# Altium project Photovoltaic Controller.PrjPcb (part 2 of 4)

## Sheet Controller.SchDoc: Controller
size A4; Project_Name: - - - - -; ApprovedBy: LD Stanton; CheckedBy: None; Author: LD Stanton; CompanyName: University of Cape Town; DrawnBy: Lawrence Stanton; Engineer: Lawrence Stanton; Organization: University of Cape Town; Address1: Department of Electrical Engineering; Address2: Rondebosch; Address3: Cape Town; Address4: South Africa 7701; DocumentNumber: 5; SheetNumber: 5; SheetTotal: 20; Approv_Date_Eng: --/--/----; Approv_Date_Chk: --/--/----; PCB_Doc: TBD; ASM_Doc: TBD; FAB_Doc: TBD; CML_Doc: TBD; BOM_Doc: TBD
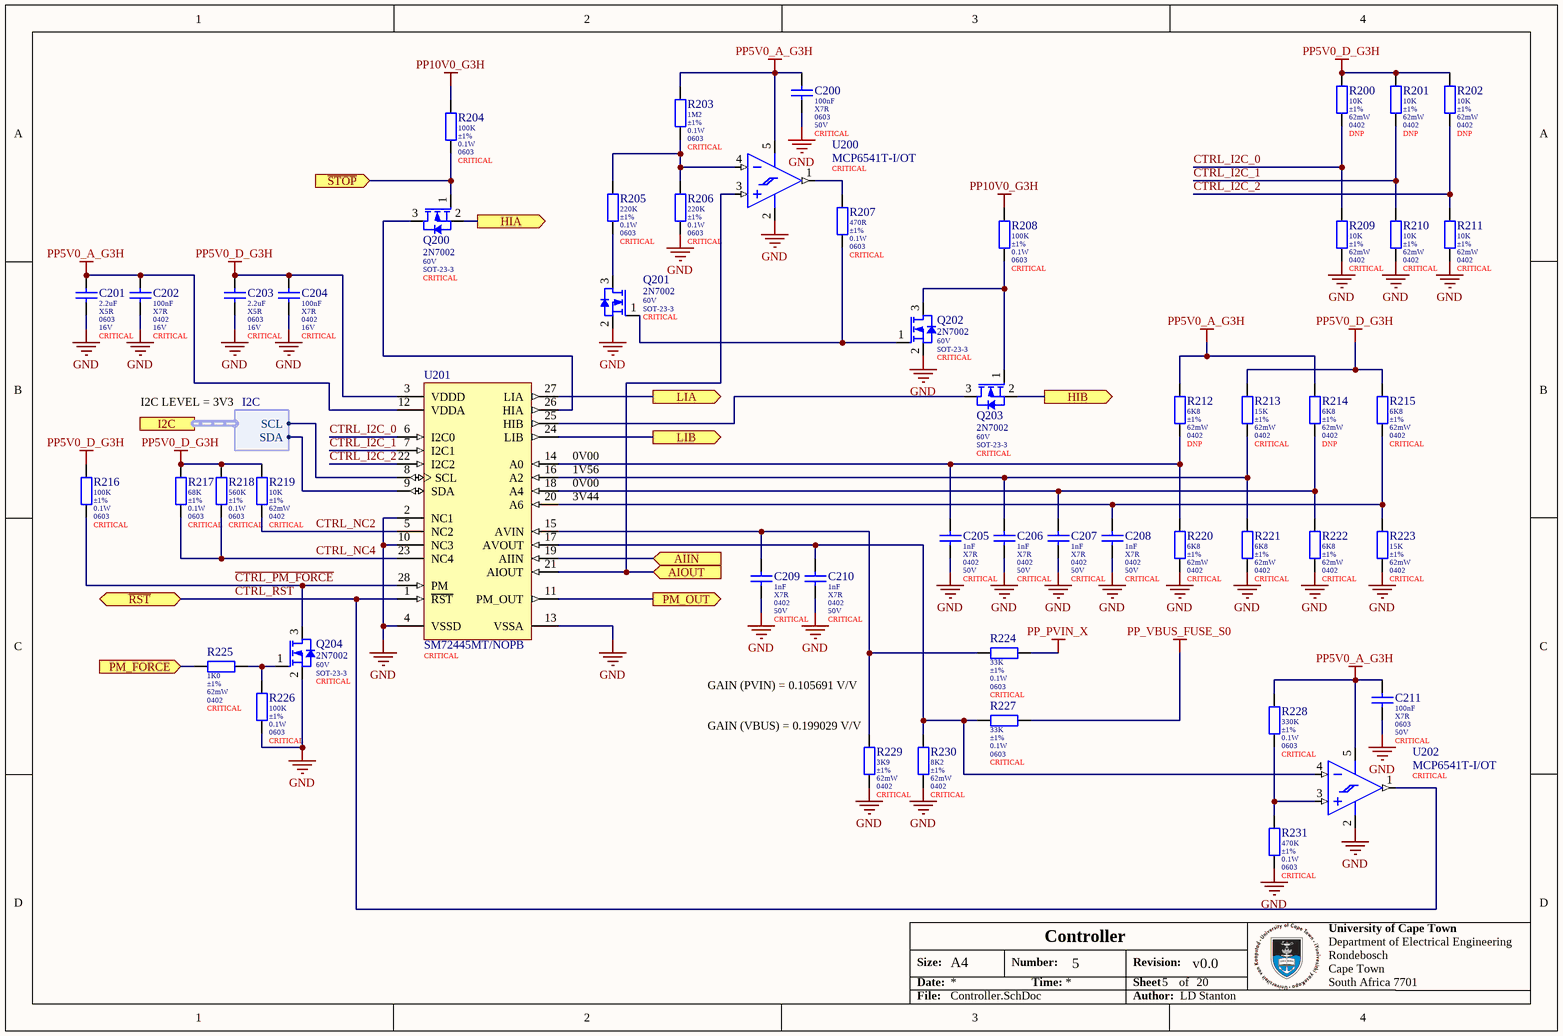
[diagram p7: Controller.SchDoc]

### Parts
C200  value 100nF  Dielectric: X7R  Package: 0603  Voltage: 50V  Populate: CRITICAL  [0603 (Yageo DA) B]  (hidden comment: CC0603KRX7R9BB104)
C201  value 2.2uF  Dielectric: X5R  Package: 0603  Voltage: 16V  Populate: CRITICAL  [0603_080_8 (Samsung) B]  (hidden comment: CL10A225KO8NNNC)
C202  value 100nF  Dielectric: X7R  Package: 0402  Voltage: 16V  Populate: CRITICAL  [0402_050_5 (Samsumg) B]  (hidden comment: CL05B104KO5NNNC)
C203  value 2.2uF  Dielectric: X5R  Package: 0603  Voltage: 16V  Populate: CRITICAL  [0603_080_8 (Samsung) B]  (hidden comment: CL10A225KO8NNNC)
C204  value 100nF  Dielectric: X7R  Package: 0402  Voltage: 16V  Populate: CRITICAL  [0402_050_5 (Samsumg) B]  (hidden comment: CL05B104KO5NNNC)
C205  value 1nF  Dielectric: X7R  Package: 0402  Voltage: 50V  Populate: CRITICAL  [0402_050 (Guandong) B]  (hidden comment: 0402B102K500NT)
C206  value 1nF  Dielectric: X7R  Package: 0402  Voltage: 50V  Populate: CRITICAL  [0402_050 (Guandong) B]  (hidden comment: 0402B102K500NT)
C207  value 1nF  Dielectric: X7R  Package: 0402  Voltage: 50V  Populate: CRITICAL  [0402_050 (Guandong) B]  (hidden comment: 0402B102K500NT)
C208  value 1nF  Dielectric: X7R  Package: 0402  Voltage: 50V  Populate: CRITICAL  [0402_050 (Guandong) B]  (hidden comment: 0402B102K500NT)
C209  value 1nF  Dielectric: X7R  Package: 0402  Voltage: 50V  Populate: CRITICAL  [0402_050 (Guandong) B]  (hidden comment: 0402B102K500NT)
C210  value 1nF  Dielectric: X7R  Package: 0402  Voltage: 50V  Populate: CRITICAL  [0402_050 (Guandong) B]  (hidden comment: 0402B102K500NT)
C211  value 100nF  Dielectric: X7R  Package: 0603  Voltage: 50V  Populate: CRITICAL  [0603 (Yageo DA) B]  (hidden comment: CC0603KRX7R9BB104)
Q200  2N7002  Maximum Drain Source Voltage: 60V  Package: SOT-23-3  Placement: CRITICAL  [SOT-23-3 (2N7002) B]
Q201  2N7002  Maximum Drain Source Voltage: 60V  Package: SOT-23-3  Placement: CRITICAL  [SOT-23-3 (2N7002) B]
Q202  2N7002  Maximum Drain Source Voltage: 60V  Package: SOT-23-3  Placement: CRITICAL  [SOT-23-3 (2N7002) B]
Q203  2N7002  Maximum Drain Source Voltage: 60V  Package: SOT-23-3  Placement: CRITICAL  [SOT-23-3 (2N7002) B]
Q204  2N7002  Maximum Drain Source Voltage: 60V  Package: SOT-23-3  Placement: CRITICAL  [SOT-23-3 (2N7002) B]
R200  value 10K  Tolerance: ±1%  Power: 62mW  Package: 0402  Populate: DNP  [0402 (Uniroyal) B]  (hidden comment: 0402WGF1002TCE)
R201  value 10K  Tolerance: ±1%  Power: 62mW  Package: 0402  Populate: DNP  [0402 (Uniroyal) B]  (hidden comment: 0402WGF1002TCE)
R202  value 10K  Tolerance: ±1%  Power: 62mW  Package: 0402  Populate: DNP  [0402 (Uniroyal) B]  (hidden comment: 0402WGF1002TCE)
R203  value 1M2  Tolerance: ±1%  Power: 0.1W  Package: 0603  Populate: CRITICAL  [0603 (Uniroyal) B]  (hidden comment: 0603WAF1204T5E)
R204  value 100K  Tolerance: ±1%  Power: 0.1W  Package: 0603  Populate: CRITICAL  [0603 (Uniroyal) B]  (hidden comment: 0603WAF1003T5E)
R205  value 220K  Tolerance: ±1%  Power: 0.1W  Package: 0603  Populate: CRITICAL  [0603 (Uniroyal) B]  (hidden comment: 0603WAF2203T5E)
R206  value 220K  Tolerance: ±1%  Power: 0.1W  Package: 0603  Populate: CRITICAL  [0603 (Uniroyal) B]  (hidden comment: 0603WAF2203T5E)
R207  value 470R  Tolerance: ±1%  Power: 0.1W  Package: 0603  Populate: CRITICAL  [0603 (Uniroyal) B]  (hidden comment: 0603WAF4700T5E)
R208  value 100K  Tolerance: ±1%  Power: 0.1W  Package: 0603  Populate: CRITICAL  [0603 (Uniroyal) B]  (hidden comment: 0603WAF1003T5E)
R209  value 10K  Tolerance: ±1%  Power: 62mW  Package: 0402  Populate: CRITICAL  [0402 (Uniroyal) B]  (hidden comment: 0402WGF1002TCE)
R210  value 10K  Tolerance: ±1%  Power: 62mW  Package: 0402  Populate: CRITICAL  [0402 (Uniroyal) B]  (hidden comment: 0402WGF1002TCE)
R211  value 10K  Tolerance: ±1%  Power: 62mW  Package: 0402  Populate: CRITICAL  [0402 (Uniroyal) B]  (hidden comment: 0402WGF1002TCE)
R212  value 6K8  Tolerance: ±1%  Power: 62mW  Package: 0402  Populate: DNP  [0402 (Uniroyal) B]  (hidden comment: 0402WGF6801TCE)
R213  value 15K  Tolerance: ±1%  Power: 62mW  Package: 0402  Populate: CRITICAL  [0402 (Uniroyal) B]  (hidden comment: 0402WGF1502TCE)
R214  value 6K8  Tolerance: ±1%  Power: 62mW  Package: 0402  Populate: DNP  [0402 (Uniroyal) B]  (hidden comment: 0402WGF6801TCE)
R215  value 6K8  Tolerance: ±1%  Power: 62mW  Package: 0402  Populate: CRITICAL  [0402 (Uniroyal) B]  (hidden comment: 0402WGF6801TCE)
R216  value 100K  Tolerance: ±1%  Power: 0.1W  Package: 0603  Populate: CRITICAL  [0603 (Uniroyal) B]  (hidden comment: 0603WAF1003T5E)
R217  value 68K  Tolerance: ±1%  Power: 0.1W  Package: 0603  Populate: CRITICAL  [0603 (Uniroyal) B]  (hidden comment: 0603WAF6802T5E)
R218  value 560K  Tolerance: ±1%  Power: 0.1W  Package: 0603  Populate: CRITICAL  [0603 (Uniroyal) B]  (hidden comment: 0603WAF5603T5E)
R219  value 10K  Tolerance: ±1%  Power: 62mW  Package: 0402  Populate: CRITICAL  [0402 (Uniroyal) B]  (hidden comment: 0402WGF1002TCE)
R220  value 6K8  Tolerance: ±1%  Power: 62mW  Package: 0402  Populate: CRITICAL  [0402 (Uniroyal) B]  (hidden comment: 0402WGF6801TCE)
R221  value 6K8  Tolerance: ±1%  Power: 62mW  Package: 0402  Populate: CRITICAL  [0402 (Uniroyal) B]  (hidden comment: 0402WGF6801TCE)
R222  value 6K8  Tolerance: ±1%  Power: 62mW  Package: 0402  Populate: CRITICAL  [0402 (Uniroyal) B]  (hidden comment: 0402WGF6801TCE)
R223  value 15K  Tolerance: ±1%  Power: 62mW  Package: 0402  Populate: CRITICAL  [0402 (Uniroyal) B]  (hidden comment: 0402WGF1502TCE)
R224  value 33K  Tolerance: ±1%  Power: 0.1W  Package: 0603  Populate: CRITICAL  [0603 (Uniroyal) B]  (hidden comment: 0603WAF3302T5E)
R225  value 1K0  Tolerance: ±1%  Power: 62mW  Package: 0402  Populate: CRITICAL  [0402 (Uniroyal) B]  (hidden comment: 0402WGF1001TCE)
R226  value 100K  Tolerance: ±1%  Power: 0.1W  Package: 0603  Populate: CRITICAL  [0603 (Uniroyal) B]  (hidden comment: 0603WAF1003T5E)
R227  value 33K  Tolerance: ±1%  Power: 0.1W  Package: 0603  Populate: CRITICAL  [0603 (Uniroyal) B]  (hidden comment: 0603WAF3302T5E)
R228  value 330K  Tolerance: ±1%  Power: 0.1W  Package: 0603  Populate: CRITICAL  [0603 (Uniroyal) B]  (hidden comment: 0603WAF3303T5E)
R229  value 3K9  Tolerance: ±1%  Power: 62mW  Package: 0402  Populate: CRITICAL  [0402 (Uniroyal) B]  (hidden comment: 0402WGF3901TCE)
R230  value 8K2  Tolerance: ±1%  Power: 62mW  Package: 0402  Populate: CRITICAL  [0402 (Uniroyal) B]  (hidden comment: 0402WGF8201TCE)
R231  value 470K  Tolerance: ±1%  Power: 0.1W  Package: 0603  Populate: CRITICAL  [0603 (Uniroyal) B]  (hidden comment: 0603WAF4703T5E)
U200  MCP6541T-I/OT  Placement: CRITICAL  [SOT-23-5 (MCP75x) B]
U201  SM72445MT/NOPB  Placement: CRITICAL  [PW0028A_N]
U202  MCP6541T-I/OT  Placement: CRITICAL  [SOT-23-5 (MCP75x) B]

### Ports
AIIN (in), AIOUT (in), HIA (out), HIB (out), I2C (harness I2C), LIA (out), LIB (out), PM_FORCE (in), PM_OUT (out), ~{RST} (bidir), ~{STOP} (in)

### Harnesses
I2C: SCL, SDA

### Nets
GND: C200.2 C201.2 C202.2 C203.2 C204.2 C205.2 C206.2 C207.2 C208.2 C209.2 C210.2 C211.2 Q201.2(S) Q202.2(S) Q204.2(S) R206.2 R209.2 R210.2 R211.2 R220.2 R221.2 R222.2 R223.2 R226.2 R229.2 R230.2 R231.2 U200.2(VSS) U201.2(NC1) U201.4(VSSD) U201.10(NC3) U201.13(VSSA) U202.2(VSS)
PP5V0_A_G3H: C200.1 C201.1 C202.1 C211.1 R203.1 R212.1 R214.1 R228.1 U200.5(VDD) U201.12(VDDA) U202.5(VDD)
PP5V0_D_G3H: C203.1 C204.1 R200.1 R201.1 R202.1 R213.1 R215.1 R216.1 R217.1 R218.1 R219.2 U201.3(VDDD)
PP10V0_G3H: R204.1 R208.1
PP_PVIN_X: R224.2
PP_VBUS_FUSE_S0: R227.2
~{CTRL_PM_FORCE}: Q204.3(D) R216.2 U201.28(PM)
~{CTRL_RST}: U201.1(~{RST}) U202.1(OUT) ; port ~{RST}  [project net CTRL_RST]
~{STOP}: Q200.1(G) R204.2 ; port ~{STOP}
CTRL_I2C_0: R200.2 R209.1 U201.6(I2C0)
CTRL_I2C_1: R201.2 R210.1 U201.7(I2C1)
CTRL_I2C_2: R202.2 R211.1 U201.22(I2C2)
CTRL_NC2: R219.1 U201.5(NC2)
CTRL_NC4: R217.2 R218.2 U201.23(NC4)
HIA: Q200.2(S) ; port HIA
HIB: Q203.2(S) ; port HIB
I2C2.SCL: U201.8(SCL) ; port I2C.SCL
I2C2.SDA: U201.9(SDA) ; port I2C.SDA
I_IN: U201.19(AIIN) ; port AIIN
I_OUT: U200.3(VIN+) U201.21(AIOUT) ; port AIOUT
LIA: U201.27(LIA) ; port LIA
LIB: U201.24(LIB) ; port LIB
PM_FORCE: R225.1 ; port PM_FORCE
PM_OUT: U201.11(PM_OUT) ; port PM_OUT
NetC205_1: C205.1 R212.2 R220.1 U201.14(A0)
NetC206_1: C206.1 R213.2 R221.1 U201.16(A2)
NetC207_1: C207.1 R214.2 R222.1 U201.18(A4)
NetC208_1: C208.1 R215.2 R223.1 U201.20(A6)
NetC209_1: C209.1 R224.1 R229.1 U201.15(AVIN)
NetC210_1: C210.1 R227.1 R230.1 U201.17(AVOUT) U202.4(VIN-)
NetQ200_3: Q200.3(D) U201.26(HIA)
NetQ201_1: Q201.1(G) Q202.1(G) R207.1
NetQ201_3: Q201.3(D) R205.2
NetQ202_3: Q202.3(D) Q203.1(G) R208.2
NetQ203_3: Q203.3(D) U201.25(HIB)
NetQ204_1: Q204.1(G) R225.2 R226.1
NetR203_2: R203.2 R205.1 R206.1 U200.4(VIN-)
NetR207_2: R207.2 U200.1(OUT)
NetR228_2: R228.2 R231.1 U202.3(VIN+)

### Notes on the sheet
- I2C LEVEL = 3V3
- (near U201) 1V56
- (near U201) 0V00
- (near U201) 3V44
- GAIN (PVIN) = 0.105691 V/V
- (near R229) GAIN (VBUS) = 0.199029 V/V
- Size:
- Date:
- A4
- Number:
- Time:
- Revision:
- Sheet
- of
- File:
- Author:

### Library data of the parts
C200 C211 = CMP-047-000000-7: as C424 on sheet RS485 Tranciever; LCSC Part Number: C14663; Tolerance: ±10%; ComponentLink1URL: https://datasheet.lcsc.com/szlcsc/YAGEO-CC0603KRX7R9BB104_C14663.pdf; ComponentLink1Description: Datasheet
C201 C203 = CMP-045-000016-8: MLCC 2.2uF 0603 16V X5R ±10%; Manufacturer: Samsung; ComponentLink1URL: https://datasheet.lcsc.com/szlcsc/Samsung-Electro-Mechanics-CL05C100JB5NNNC_C32949.pdf; LCSC Part Number: C23630; Tolerance: ±10%; ComponentLink1Description: Datasheet
C202 C204 = CMP-045-000014-12: as C401 on sheet MCU; Tolerance: ±10%; ComponentLink1Description: Datasheet; ComponentLink1URL: https://datasheet.lcsc.com/szlcsc/Samsung-Electro-Mechanics-CL05C100JB5NNNC_C32949.pdf; LCSC Part Number: C1525
C205-C210 = CMP-014-000001-9: MLCC 1nF 0402 50V X7R ±10%; Manufacturer: Guandong; LCSC Part Number: C1523; ComponentLink1URL: https://datasheet.lcsc.com/szlcsc/Guangdong-Fenghua-Advanced-Tech-0402B102K500NT_C1523.pdf; ComponentLink1Description: Datasheet; Tolerance: ±10%
Q200-Q204 = CMP-040-000000-14: Small Signal MOSFET, 500 mA, 60 V, N-Channel, Enhancement, JCET SOT-23-3; Gate Threshold Voltage: 2V5; Power: 0.225W; Maximum Drain Current: 0.2A; Maximum Gate Source Voltage: ±20V; Drain-Source On Resistance: 7R; ComponentLink1Description: Datasheet; LCSC Part Number: C8545; ComponentLink1URL: https://datasheet.lcsc.com/szlcsc/Changjiang-Electronics-Tech-CJ-2N7002_C8545.pdf; Manufacturer: JCET
R200-R202 R209-R211 R219 = CMP-010-000292-12: Resistor 10K 0402 ±1% Thick Film Uniroyal; Working Voltage: 50V; Temperature Coefficient: ±100ppm/K; Manufacturer: Uniroyal; Pin Count: 2; ComponentLink1URL: https://datasheet.lcsc.com/szlcsc/1811062009_UNI-ROYAL-Uniroyal-Elec-0603WAF1002T5E_C25804.pdf; LCSC Part Number: C25744; Temperature: -55 - 155°C; ComponentLink1Description: Datasheet
R203 = CMP-010-000374-4: Resistor 1M2 0603 ±1% Thick Film Uniroyal; Temperature Coefficient: ±100ppm/K; Working Voltage: 75V; Temperature: -55 - 155°C; Pin Count: 2; ComponentLink1URL: https://datasheet.lcsc.com/szlcsc/1811062009_UNI-ROYAL-Uniroyal-Elec-0603WAF1002T5E_C25804.pdf; Manufacturer: Uniroyal; LCSC Part Number: C13315; ComponentLink1Description: Datasheet
R204 R208 R216 R226 = CMP-010-000288-10: as R412 on sheet MCU; Manufacturer: Uniroyal; ComponentLink1URL: https://datasheet.lcsc.com/szlcsc/1811062009_UNI-ROYAL-Uniroyal-Elec-0603WAF1002T5E_C25804.pdf; LCSC Part Number: C25803; Temperature: -55 - 155°C; ComponentLink1Description: Datasheet; Pin Count: 2
R205 R206 = CMP-010-000401-2: Resistor 220K 0603 ±1% Thick Film Uniroyal; Temperature Coefficient: ±100ppm/K; Working Voltage: 75V; ComponentLink1URL: https://datasheet.lcsc.com/szlcsc/1811062009_UNI-ROYAL-Uniroyal-Elec-0603WAF1002T5E_C25804.pdf; Manufacturer: Uniroyal; LCSC Part Number: C22961; Temperature: -55 - 155°C; Pin Count: 2; ComponentLink1Description: Datasheet
R207 = CMP-010-000381-2: Resistor 470R 0603 ±5% Thick Film Uniroyal; Working Voltage: 75V; Temperature Coefficient: ±100ppm/K; ComponentLink1Description: Datasheet; Manufacturer: Uniroyal; Temperature: -55 - 155°C; LCSC Part Number: C23179; ComponentLink1URL: https://datasheet.lcsc.com/szlcsc/1811062009_UNI-ROYAL-Uniroyal-Elec-0603WAF1002T5E_C25804.pdf; Pin Count: 2
R212 R214 R215 R220-R222 = CMP-010-000385-1: Resistor 6K8 0402 ±1% Thick Film Uniroyal; Temperature Coefficient: ±100ppm/K; Working Voltage: 50V; Manufacturer: Uniroyal; LCSC Part Number: C25917; ComponentLink1Description: Datasheet; Temperature: -55 - 155°C; ComponentLink1URL: https://datasheet.lcsc.com/szlcsc/1811062009_UNI-ROYAL-Uniroyal-Elec-0603WAF1002T5E_C25804.pdf; Pin Count: 2
R213 R223 = CMP-010-000399-1: Resistor 15K 0402 ±1% Thick Film Uniroyal; Working Voltage: 50V; Temperature Coefficient: ±100ppm/K; ComponentLink1Description: Datasheet; Manufacturer: Uniroyal; Temperature: -55 - 155°C; LCSC Part Number: C25756; ComponentLink1URL: https://datasheet.lcsc.com/szlcsc/1811062009_UNI-ROYAL-Uniroyal-Elec-0603WAF1002T5E_C25804.pdf; Pin Count: 2
R217 = CMP-010-000350-9: Resistor 68K 0603 ±1% Thick Film Uniroyal; Working Voltage: 75V; Temperature Coefficient: ±100ppm/K; ComponentLink1Description: Datasheet; LCSC Part Number: C23231; ComponentLink1URL: https://datasheet.lcsc.com/szlcsc/1811062009_UNI-ROYAL-Uniroyal-Elec-0603WAF1002T5E_C25804.pdf; Temperature: -55 - 155°C; Pin Count: 2; Manufacturer: Uniroyal
R218 = CMP-010-000354-6: Resistor 560K 0603 ±1% Thick Film Uniroyal; Working Voltage: 75V; Temperature Coefficient: ±100ppm/K; Temperature: -55 - 155°C; Pin Count: 2; ComponentLink1URL: https://datasheet.lcsc.com/szlcsc/1811062009_UNI-ROYAL-Uniroyal-Elec-0603WAF1002T5E_C25804.pdf; ComponentLink1Description: Datasheet; LCSC Part Number: C23203; Manufacturer: Uniroyal
R224 R227 = CMP-010-000332-10: Resistor 33K 0603 ±1% Thick Film Uniroyal; Working Voltage: 75V; Temperature Coefficient: ±100ppm/K; Temperature: -55 - 155°C; ComponentLink1URL: https://datasheet.lcsc.com/szlcsc/1811062009_UNI-ROYAL-Uniroyal-Elec-0603WAF1002T5E_C25804.pdf; Manufacturer: Uniroyal; LCSC Part Number: C4216; ComponentLink1Description: Datasheet; Pin Count: 2
R225 = CMP-010-000307-13: Resistor 1K0 0402 ±1% Thick Film Uniroyal; Working Voltage: 50V; Temperature Coefficient: ±100ppm/K; Temperature: -55 - 155°C; ComponentLink1URL: https://datasheet.lcsc.com/szlcsc/1811062009_UNI-ROYAL-Uniroyal-Elec-0603WAF1002T5E_C25804.pdf; Manufacturer: Uniroyal; Pin Count: 2; ComponentLink1Description: Datasheet; LCSC Part Number: C11702
R228 = CMP-010-000382-2: Resistor 330K 0603 ±1% Thick Film Uniroyal; Temperature Coefficient: ±100ppm/K; Working Voltage: 75V; Pin Count: 2; Manufacturer: Uniroyal; ComponentLink1URL: https://datasheet.lcsc.com/szlcsc/1811062009_UNI-ROYAL-Uniroyal-Elec-0603WAF1002T5E_C25804.pdf; LCSC Part Number: C23137; Temperature: -55 - 155°C; ComponentLink1Description: Datasheet
R229 = CMP-010-000334-13: Resistor 3K9 0402 ±1% Thick Film Uniroyal; Working Voltage: 50V; Temperature Coefficient: ±100ppm/K; Manufacturer: Uniroyal; LCSC Part Number: C51721; Temperature: -55 - 155°C; ComponentLink1URL: https://datasheet.lcsc.com/szlcsc/1811062009_UNI-ROYAL-Uniroyal-Elec-0603WAF1002T5E_C25804.pdf; ComponentLink1Description: Datasheet; Pin Count: 2
R230 = CMP-010-000386-1: Resistor 8K2 0402 ±1% Thick Film Uniroyal; Working Voltage: 50V; Temperature Coefficient: ±100ppm/K; ComponentLink1Description: Datasheet; ComponentLink1URL: https://datasheet.lcsc.com/szlcsc/1811062009_UNI-ROYAL-Uniroyal-Elec-0603WAF1002T5E_C25804.pdf; LCSC Part Number: C25924; Manufacturer: Uniroyal; Temperature: -55 - 155°C; Pin Count: 2
R231 = CMP-010-000402-2: Resistor 470K 0603 ±1% Thick Film Uniroyal; Temperature Coefficient: ±100ppm/K; Working Voltage: 75V; ComponentLink1URL: https://datasheet.lcsc.com/szlcsc/1811062009_UNI-ROYAL-Uniroyal-Elec-0603WAF1002T5E_C25804.pdf; Pin Count: 2; Temperature: -55 - 155°C; LCSC Part Number: C23178; ComponentLink1Description: Datasheet; Manufacturer: Uniroyal
U200 U202 = CMP-000025-4: Comparator, Push-Pull, 1V6-5V5, 600nA,  SOT-23-5; Min Supply Voltage: 1.6V; Max Supply Voltage: 5.5V; Propagation Delay: 8us; Quiescent Current: 1uA; Nominal Supply Current: 1mA; Input Bias Current: 1pA; Input Offset Voltage (Vos): 7mV; Hysteresis: 6.5mV; Output Current: 2mA; Package: SOT-23-5; ComponentLink1Description: Datasheet; Output Type: Push-Pull; Min Operating Temperature: -40°C; RoHS: Yes; Max Operating Temperature: 85°C; ComponentLink1URL: https://ww1.microchip.com/downloads/en/DeviceDoc/MCP6541%20Output%20SubMicroamp%20Comparators%2020001696K.pdf; LCSC Part Number: C80839
U201 = CMP-019-00000-4: Texas Instruments MPPT Photovoltaic Cell Controller, 220kHz, TSSOP-28; Min Input Voltage: 4.75V; Input Current: 10nA; Max Supply Voltage: 5.25V; Supply Current: 11.5mA; RoHS: Yes; Max Operating Temperature: 105°C; Min Operating Temperature: -40°C; Height: 0.9mm; ComponentLink1URL: https://www.ti.com/lit/ds/symlink/sm72442.pdf?ts=1624215339045&ref_url=https%253A%252F%252Fwww.ti.com%252Fproduct%252FSM72442; ComponentLink1Description: Datasheet; Max Input Voltage: 5.25V; Case/Package: TSSOP; Min Supply Voltage: 4.75V

## Sheet Bridge Regulator.SchDoc: Full Bridge Regulator
size A4; ApprovedBy: LD Stanton; CheckedBy: None; Author: LD Stanton; CompanyName: University of Cape Town; DrawnBy: Lawrence Stanton; Engineer: Lawrence Stanton; Organization: University of Cape Town; Address1: Department of Electrical Engineering; Address2: Rondebosch; Address3: Cape Town; Address4: South Africa 7701; DocumentNumber: 6; SheetNumber: 6; SheetTotal: 20; Approv_Date_Eng: --/--/----; Approv_Date_Chk: --/--/----; PCB_Doc: TBD; ASM_Doc: TBD; FAB_Doc: TBD; CML_Doc: TBD; BOM_Doc: TBD
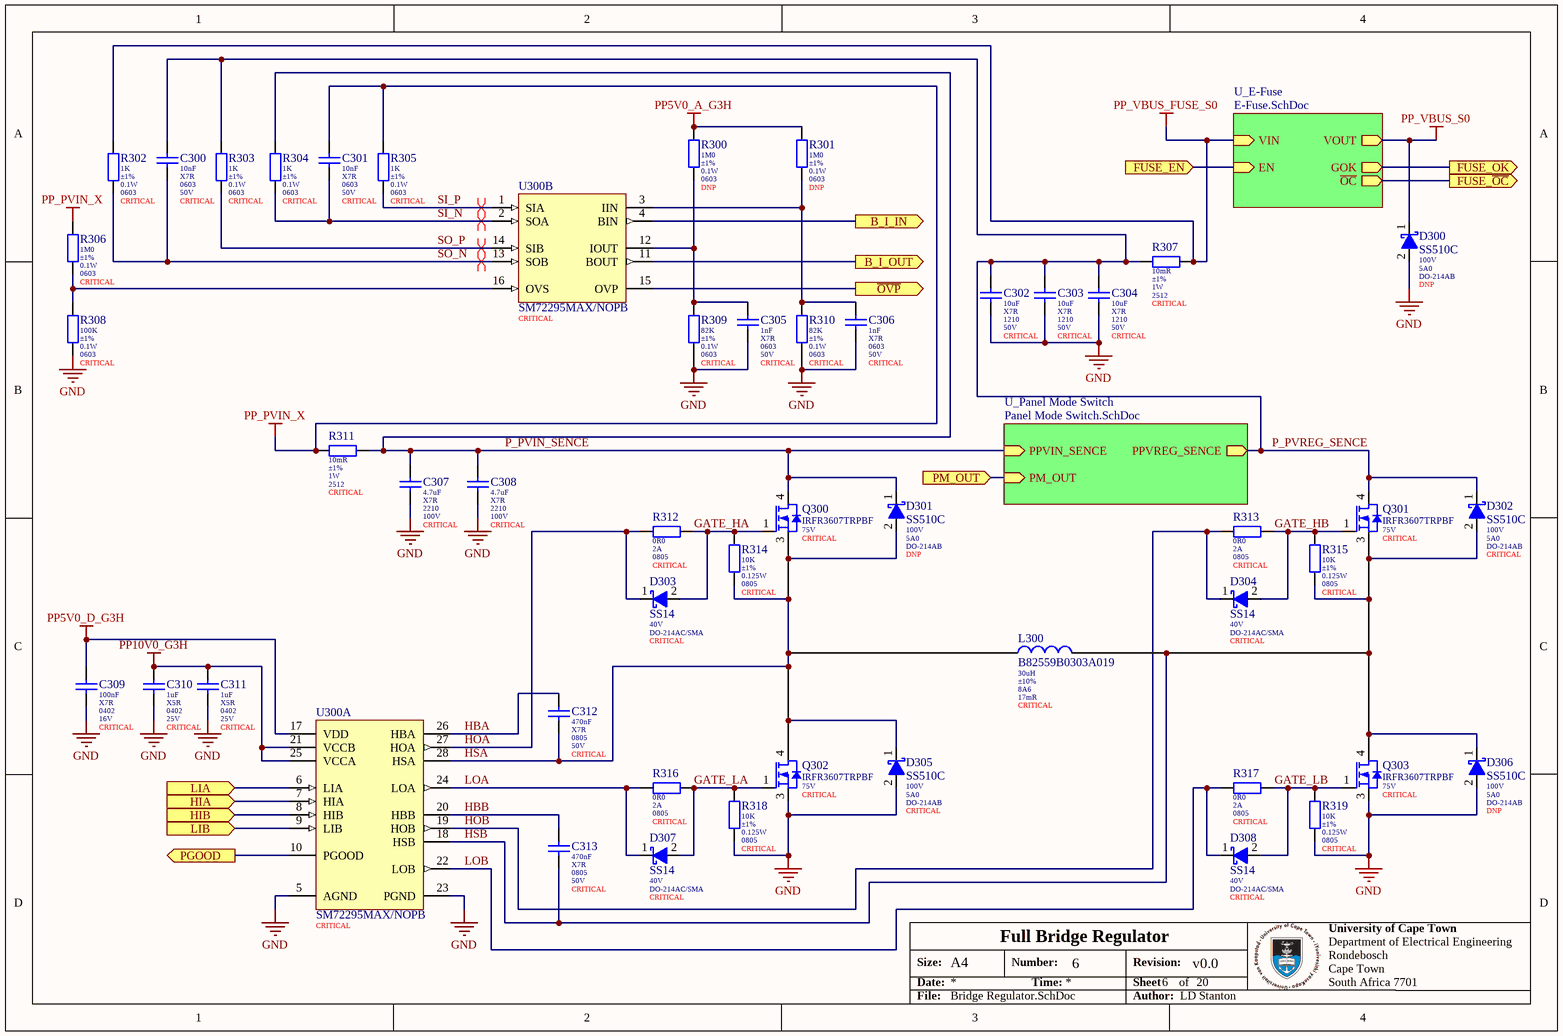
[diagram p8: Bridge Regulator.SchDoc]

### Parts
C300  value 10nF  Dielectric: X7R  Package: 0603  Voltage: 50V  Populate: CRITICAL  [0603_080 (Guandong) B]  (hidden comment: 0603B103K500NT)
C301  value 10nF  Dielectric: X7R  Package: 0603  Voltage: 50V  Populate: CRITICAL  [0603_080 (Guandong) B]  (hidden comment: 0603B103K500NT)
C302  value 10uF  Dielectric: X7R  Package: 1210  Voltage: 50V  Populate: CRITICAL  [1212_250_J (Samsumg) B]  (hidden comment: CL32B106KBJNFNE)
C303  value 10uF  Dielectric: X7R  Package: 1210  Voltage: 50V  Populate: CRITICAL  [1212_250_J (Samsumg) B]  (hidden comment: CL32B106KBJNFNE)
C304  value 10uF  Dielectric: X7R  Package: 1210  Voltage: 50V  Populate: CRITICAL  [1212_250_J (Samsumg) B]  (hidden comment: CL32B106KBJNFNE)
C305  value 1nF  Dielectric: X7R  Package: 0603  Voltage: 50V  Populate: CRITICAL  [0603_080_8 (Samsung) B]  (hidden comment: CL10B102KB8NNNC)
C306  value 1nF  Dielectric: X7R  Package: 0603  Voltage: 50V  Populate: CRITICAL  [0603_080_8 (Samsung) B]  (hidden comment: CL10B102KB8NNNC)
C307  value 4.7uF  Dielectric: X7R  Package: 2210  Voltage: 100V  Populate: CRITICAL  [2220_F (PSA) B]  (hidden comment: FS55X475K101EGG)
C308  value 4.7uF  Dielectric: X7R  Package: 2210  Voltage: 100V  Populate: CRITICAL  [2220_F (PSA) B]  (hidden comment: FS55X475K101EGG)
C309  value 100nF  Dielectric: X7R  Package: 0402  Voltage: 16V  Populate: CRITICAL  [0402_050_5 (Samsumg) B]  (hidden comment: CL05B104KO5NNNC)
C310  value 1uF  Dielectric: X5R  Package: 0402  Voltage: 25V  Populate: CRITICAL  [0402_050_5 (Samsumg) B]  (hidden comment: CL05A105KA5NQNC)
C311  value 1uF  Dielectric: X5R  Package: 0402  Voltage: 25V  Populate: CRITICAL  [0402_050_5 (Samsumg) B]  (hidden comment: CL05A105KA5NQNC)
C312  value 470nF  Dielectric: X7R  Package: 0805  Voltage: 50V  Populate: CRITICAL  [0805_125_F (Samsumg) B]  (hidden comment: CL21B474KBFNNNE)
C313  value 470nF  Dielectric: X7R  Package: 0805  Voltage: 50V  Populate: CRITICAL  [0805_125_F (Samsumg) B]  (hidden comment: CL21B474KBFNNNE)
D300  SS510C  Blocking Voltage: 100V  Forward Current: 5A0  Package: DO-214AB  Placement: DNP  [DO-214AB/SMC (MDD) B]
D301  SS510C  Blocking Voltage: 100V  Forward Current: 5A0  Package: DO-214AB  Placement: DNP  [DO-214AB/SMC (MDD) B]
D302  SS510C  Blocking Voltage: 100V  Forward Current: 5A0  Package: DO-214AB  Placement: CRITICAL  [DO-214AB/SMC (MDD) B]
D303  SS14  Blocking Voltage: 40V  Package: DO-214AC/SMA  Placement: CRITICAL  [DO-214AC (MDD) B]
D304  SS14  Blocking Voltage: 40V  Package: DO-214AC/SMA  Placement: CRITICAL  [DO-214AC (MDD) B]
D305  SS510C  Blocking Voltage: 100V  Forward Current: 5A0  Package: DO-214AB  Placement: CRITICAL  [DO-214AB/SMC (MDD) B]
D306  SS510C  Blocking Voltage: 100V  Forward Current: 5A0  Package: DO-214AB  Placement: DNP  [DO-214AB/SMC (MDD) B]
D307  SS14  Blocking Voltage: 40V  Package: DO-214AC/SMA  Placement: CRITICAL  [DO-214AC (MDD) B]
D308  SS14  Blocking Voltage: 40V  Package: DO-214AC/SMA  Placement: CRITICAL  [DO-214AC (MDD) B]
L300  B82559B0303A019  value 30uH  Tolerance: ±10%  Rated Current: 8A6  DC Resistance: 17mR  Placement: CRITICAL  [B82559B0303A019-Footprint-1]
Q300  IRFR3607TRPBF  Maximum Drain Source Voltage: 75V  Placement: CRITICAL  [TO-252A (IRFR3607) B]
Q301  IRFR3607TRPBF  Maximum Drain Source Voltage: 75V  Placement: CRITICAL  [TO-252A (IRFR3607) B]
Q302  IRFR3607TRPBF  Maximum Drain Source Voltage: 75V  Placement: CRITICAL  [TO-252A (IRFR3607) B]
Q303  IRFR3607TRPBF  Maximum Drain Source Voltage: 75V  Placement: CRITICAL  [TO-252A (IRFR3607) B]
R300  value 1M0  Tolerance: ±1%  Power: 0.1W  Package: 0603  Populate: DNP  [0603 (Uniroyal) B]  (hidden comment: 0603WAF1004T5E)
R301  value 1M0  Tolerance: ±1%  Power: 0.1W  Package: 0603  Populate: DNP  [0603 (Uniroyal) B]  (hidden comment: 0603WAF1004T5E)
R302  value 1K  Tolerance: ±1%  Power: 0.1W  Package: 0603  Populate: CRITICAL  [0603 (Uniroyal) B]  (hidden comment: 0603WAF1001T5E)
R303  value 1K  Tolerance: ±1%  Power: 0.1W  Package: 0603  Populate: CRITICAL  [0603 (Uniroyal) B]  (hidden comment: 0603WAF1001T5E)
R304  value 1K  Tolerance: ±1%  Power: 0.1W  Package: 0603  Populate: CRITICAL  [0603 (Uniroyal) B]  (hidden comment: 0603WAF1001T5E)
R305  value 1K  Tolerance: ±1%  Power: 0.1W  Package: 0603  Populate: CRITICAL  [0603 (Uniroyal) B]  (hidden comment: 0603WAF1001T5E)
R306  value 1M0  Tolerance: ±1%  Power: 0.1W  Package: 0603  Populate: CRITICAL  [0603 (Uniroyal) B]  (hidden comment: 0603WAF1004T5E)
R307  value 10mR  Tolerance: ±1%  Power: 1W  Package: 2512  Populate: CRITICAL  [2512 (Uniroyal) B]  (hidden comment: 25121WF100MT4E)
R308  value 100K  Tolerance: ±1%  Power: 0.1W  Package: 0603  Populate: CRITICAL  [0603 (Uniroyal) B]  (hidden comment: 0603WAF1003T5E)
R309  value 82K  Tolerance: ±1%  Power: 0.1W  Package: 0603  Populate: CRITICAL  [0603 (Uniroyal) B]  (hidden comment: 0603WAF8202T5E)
R310  value 82K  Tolerance: ±1%  Power: 0.1W  Package: 0603  Populate: CRITICAL  [0603 (Uniroyal) B]  (hidden comment: 0603WAF8202T5E)
R311  value 10mR  Tolerance: ±1%  Power: 1W  Package: 2512  Populate: CRITICAL  [2512 (Uniroyal) B]  (hidden comment: 25121WF100MT4E)
R312  value 0R0  Current: 2A  Package: 0805  Populate: CRITICAL  [0805 (Uniroyal) B]  (hidden comment: 0805W8F0000T5E)
R313  value 0R0  Current: 2A  Package: 0805  Populate: CRITICAL  [0805 (Uniroyal) B]  (hidden comment: 0805W8F0000T5E)
R314  value 10K  Tolerance: ±1%  Power: 0.125W  Package: 0805  Populate: CRITICAL  [0805 (Uniroyal) B]  (hidden comment: 0805W8F1002T5E)
R315  value 10K  Tolerance: ±1%  Power: 0.125W  Package: 0805  Populate: CRITICAL  [0805 (Uniroyal) B]  (hidden comment: 0805W8F1002T5E)
R316  value 0R0  Current: 2A  Package: 0805  Populate: CRITICAL  [0805 (Uniroyal) B]  (hidden comment: 0805W8F0000T5E)
R317  value 0R0  Current: 2A  Package: 0805  Populate: CRITICAL  [0805 (Uniroyal) B]  (hidden comment: 0805W8F0000T5E)
R318  value 10K  Tolerance: ±1%  Power: 0.125W  Package: 0805  Populate: CRITICAL  [0805 (Uniroyal) B]  (hidden comment: 0805W8F1002T5E)
R319  value 10K  Tolerance: ±1%  Power: 0.125W  Package: 0805  Populate: CRITICAL  [0805 (Uniroyal) B]  (hidden comment: 0805W8F1002T5E)
U300  SM72295MAX/NOPB  Placement: CRITICAL  [DW0028A_N]  (parts A,B of 2)

### Sub-sheets
U_E-Fuse = E-Fuse.SchDoc: VIN (in), VOUT (out), EN (in), GOK (out), ~{OC} (out)
U_Panel Mode Switch = Panel Mode Switch.SchDoc: PM_OUT (in), PPVIN_SENCE (in), PPVREG_SENCE (out)

### Ports
B_I_IN (out), B_I_OUT (out), FUSE_EN (in), FUSE_OK (out), FUSE_~{OC} (out), HIA (in), HIB (in), LIA (in), LIB (in), PGOOD (out), PM_OUT (in), ~{OVP} (out)

### Nets
GND: C302.2 C303.2 C304.2 C305.2 C306.2 C307.2 C308.2 C309.2 C310.2 C311.2 D300.2(A) D305.2(A) D306.2(A) Q302.3(S) Q303.3(S) R308.2 R309.2 R310.2 R318.2 R319.2 U300.5(AGND) U300.23(PGND)
PP5V0_A_G3H: R300.1 R301.1
PP5V0_D_G3H: C309.1 U300.17(VDD)
PP10V0_G3H: C310.1 C311.1 U300.21(VCCB) U300.25(VCCA)
PP_PVIN_X: C301.1 R305.1 R306.1 R311.1
PP_VBUS_FUSE_S0: R302.1 R307.2 ; sheet U_E-Fuse/VIN
PP_VBUS_S0: D300.1(K) ; sheet U_E-Fuse/VOUT
~{STOP}: port FUSE_EN, sheet U_E-Fuse/EN
CTRL_RST: U300.15(OVP) ; port ~{OVP}
FUSE_OC: port FUSE_~{OC}, sheet U_E-Fuse/~{OC}
FUSE_OK: port FUSE_OK, sheet U_E-Fuse/GOK
GATE_HA: D303.2(A) Q300.1(G) R312.2 R314.1
GATE_HB: D304.2(A) Q301.1(G) R313.2 R315.1
GATE_LA: D307.2(A) Q302.1(G) R316.2 R318.1
GATE_LB: D308.2(A) Q303.1(G) R317.2 R319.1
HBA: C312.1 U300.26(HBA)
HBB: C313.1 U300.20(HBB)
HIA: U300.7(HIA) ; port HIA
HIB: U300.8(HIB) ; port HIB
HOA: D303.1(K) R312.1 U300.27(HOA)
HOB: D304.1(K) R313.1 U300.19(HOB)
HSA: C312.2 D301.2(A) D305.1(K) L300.1 Q300.3(S) Q302.4(D) R314.2 U300.28(HSA)
HSB: C313.2 D302.2(A) D306.1(K) L300.2 Q301.3(S) Q303.4(D) R315.2 U300.18(HSB)
I_IN: U300.4(BIN) ; port B_I_IN
I_OUT: U300.11(BOUT) ; port B_I_OUT
LIA: U300.6(LIA) ; port LIA
LIB: U300.9(LIB) ; port LIB
LOA: D307.1(K) R316.1 U300.24(LOA)
LOB: D308.1(K) R317.1 U300.22(LOB)
P_PVIN_SENCE: C307.1 C308.1 D301.1(K) Q300.4(D) R304.1 R311.2 ; sheet U_Panel Mode Switch/PPVIN_SENCE
P_PVREG_SENCE: C300.1 C302.1 C303.1 C304.1 D302.1(K) Q301.4(D) R303.1 R307.1 ; sheet U_Panel Mode Switch/PPVREG_SENCE
PGOOD: U300.10(PGOOD) ; port PGOOD
PM_OUT: port PM_OUT, sheet U_Panel Mode Switch/PM_OUT
SI_N: C301.2 R304.2 U300.2(SOA)
SI_P: R305.2 U300.1(SIA)
SO_N: C300.2 R302.2 U300.13(SOB)
SO_P: R303.2 U300.14(SIB)
NetC305_1: C305.1 R300.2 R309.1 U300.12(IOUT)
NetC306_1: C306.1 R301.2 R310.1 U300.3(IIN)
NetR306_2: R306.2 R308.1 U300.16(OVS)

### Layout directives
differential pair: SI_N, SI_P, SO_N, SO_P

### Notes on the sheet
- Size:
- Date:
- A4
- Number:
- Time:
- Revision:
- Sheet
- of
- File:
- Author:

### Library data of the parts
C300 C301 = CMP-014-000000-11: MLCC 10nF 0603 50V X7R ±10%; Manufacturer: Guandong; Tolerance: ±15%; ComponentLink1Description: Datasheet; LCSC Part Number: C57112; ComponentLink1URL: https://datasheet.lcsc.com/szlcsc/Guangdong-Fenghua-Advanced-Tech-0402B102K500NT_C1523.pdf
C302-C304 = CMP-014-000017-1: MLCC 10uF 1210 50V X7R ±10%; Manufacturer: Samsung; LCSC Part Number: C18739; ComponentLink1URL: https://datasheet.lcsc.com/szlcsc/Samsung-Electro-Mechanics-CL05C100JB5NNNC_C32949.pdf; Tolerance: ±10%; ComponentLink1Description: Datasheet
C305 C306 = CMP-045-000000-8: MLCC 1nF 0603 50V X7R ±10%; Manufacturer: Samsung; Tolerance: ±10%; ComponentLink1URL: https://datasheet.lcsc.com/szlcsc/Samsung-Electro-Mechanics-CL05C100JB5NNNC_C32949.pdf; LCSC Part Number: C1588; ComponentLink1Description: Datasheet
C307 C308 = CMP-014-000011-1: MLCC 4.7uF 2220 100V X7R ±10%; Manufacturer: Prosperity Dielectrics; Tolerance: ±10%; ComponentLink1URL: https://datasheet.lcsc.com/lcsc/1811111621_PSA-Prosperity-Dielectrics-FS55X475K101EGG_C153031.pdf; ComponentLink1Description: Datasheet; LCSC Part Number: C153031
C309 = CMP-045-000014-12: MLCC 100nF 0402 16V X7R ±10%; Manufacturer: Samsung; Tolerance: ±10%; ComponentLink1Description: Datasheet; ComponentLink1URL: https://datasheet.lcsc.com/szlcsc/Samsung-Electro-Mechanics-CL05C100JB5NNNC_C32949.pdf; LCSC Part Number: C1525
C310 C311 = CMP-045-000001-7: MLCC 1uF 0402 25V X5R ±10%; Manufacturer: Samsung; ComponentLink1Description: Datasheet; ComponentLink1URL: https://datasheet.lcsc.com/szlcsc/Samsung-Electro-Mechanics-CL05C100JB5NNNC_C32949.pdf; Tolerance: ±10%; LCSC Part Number: C52923
C312 C313 = CMP-014-000014-1: MLCC 470nF 0805 50V X7R ±10%; Manufacturer: Samsung; LCSC Part Number: C13967; Tolerance: ±10%; ComponentLink1Description: Datasheet; ComponentLink1URL: https://datasheet.lcsc.com/szlcsc/Samsung-Electro-Mechanics-CL05C100JB5NNNC_C32949.pdf
D300 D301 D306 = CMP-022-000008-5: Schottky Barrier Diode 100V 5A 850mV SMC MDD; LCSC Part Number: C19229; ComponentLink1Description: Datasheet; ComponentLink1URL: https://datasheet.lcsc.com/lcsc/2012031610_MDD（Microdiode-Electronics）-SS510C_C19229.pdf
D302 D305 = CMP-022-000008-6: Schottky Barrier Diode 100V 5A 850mV SMC MDD; LCSC Part Number: C19229; ComponentLink1Description: Datasheet; ComponentLink1URL: https://datasheet.lcsc.com/lcsc/2012031610_MDD（Microdiode-Electronics）-SS510C_C19229.pdf; Manufacturer: MDD
D303 D304 D307 D308 = CMP-022-000000-2: Schottky Barrier Diode 40V 1A; ComponentLink1URL: https://datasheet.lcsc.com/szlcsc/1903051003_MDD-Jiangsu-Yutai-Elec-SS14_C2480.pdf; LCSC Part Number: C2480; Forward Curent: 1A; ComponentLink1Description: Datasheet
L300 = CMP-000028-5: Helically Would High Current Inductor. 30uH, 8.6A, 17mOhm; Manufacturor: TDK; Core: Ferrite; Saturation Current: 11A5; ComponentLink1Description: Datasheet; ComponentLink1URL: https://media.digikey.com/pdf/Data%20Sheets/TDK%20PDFs/B82559BxA019_Series_DS.pdf
Q300-Q303 = CMP-013-00000-2: Single N-Channel 75V 9mR 84nC Power MOSFET TO-252; Input Capacitance: 3.07nF; Max Power Dissipation: 140W; Continuous Drain Current: 56A; ComponentLink1Description: Datasheet; ComponentLink1URL: https://datasheet.lcsc.com/lcsc/1810121140_Infineon-Technologies-IRFR3607TRPBF_C74775.pdf; LCSC Part Number: C74775; Max Operating Temperature: 175°C; Drain Source Resistance: 9mR; Case/Package: TO-252; Min Operating Temperature: -55°C
R300 R301 = CMP-010-000313-11: Resistor 1M0 0603 ±1% Thick Film Uniroyal; Working Voltage: 50V; Temperature Coefficient: ±100ppm/K; Manufacturer: Uniroyal; Pin Count: 2; LCSC Part Number: C22935; Temperature: -55 - 155°C; ComponentLink1Description: Datasheet; ComponentLink1URL: https://datasheet.lcsc.com/szlcsc/1811062009_UNI-ROYAL-Uniroyal-Elec-0603WAF1002T5E_C25804.pdf
R302-R305 = CMP-010-000308-11: Resistor 1K0 0603 ±1% Thick Film Uniroyal; Working Voltage: 75V; Temperature Coefficient: ±100ppm/K; ComponentLink1URL: https://datasheet.lcsc.com/szlcsc/1811062009_UNI-ROYAL-Uniroyal-Elec-0603WAF1002T5E_C25804.pdf; LCSC Part Number: C21190; Pin Count: 2; Manufacturer: Uniroyal; ComponentLink1Description: Datasheet; Temperature: -55 - 155°C
R306 = CMP-010-000313-12: Resistor 1M0 0603 ±1% Thick Film Uniroyal; Working Voltage: 75V; Temperature Coefficient: ±100ppm/K; Manufacturer: Uniroyal; Pin Count: 2; LCSC Part Number: C22935; Temperature: -55 - 155°C; ComponentLink1Description: Datasheet; ComponentLink1URL: https://datasheet.lcsc.com/szlcsc/1811062009_UNI-ROYAL-Uniroyal-Elec-0603WAF1002T5E_C25804.pdf
R307 R311 = CMP-010-000388-1: Resistor 10mR 2512 ±1% Thick Film Current Sense Uniroyal; Temperature Coefficient: ±800ppm/K; Working Voltage: 200V; LCSC Part Number: C127692; ComponentLink1Description: Datasheet; Manufacturer: Uniroyal; Pin Count: 2; ComponentLink1URL: https://datasheet.lcsc.com/lcsc/1810301111_UNI-ROYAL-Uniroyal-Elec-25121WF100MT4E_C127692.pdf; Temperature: -55 - 155°C
R308 = CMP-010-000288-10: Resistor 100K 0603 ±1% Thick Film Uniroyal; Working Voltage: 75V; Temperature Coefficient: ±100ppm/K; Manufacturer: Uniroyal; ComponentLink1URL: https://datasheet.lcsc.com/szlcsc/1811062009_UNI-ROYAL-Uniroyal-Elec-0603WAF1002T5E_C25804.pdf; LCSC Part Number: C25803; Temperature: -55 - 155°C; ComponentLink1Description: Datasheet; Pin Count: 2
R309 R310 = CMP-010-000347-9: Resistor 82K 0603 ±1% Thick Film Uniroyal; Temperature Coefficient: ±100ppm/K; Working Voltage: 75V; ComponentLink1Description: Datasheet; LCSC Part Number: C23254; Temperature: -55 - 155°C; ComponentLink1URL: https://datasheet.lcsc.com/szlcsc/1811062009_UNI-ROYAL-Uniroyal-Elec-0603WAF1002T5E_C25804.pdf; Pin Count: 2; Manufacturer: Uniroyal
R312 R313 R316 R317 = CMP-010-000281-12: Jumper 0805 2A Uniroyal; LCSC Part Number: C17477; Manufacturer: Uniroyal; Temperature: -55 - 155°C; ComponentLink1URL: https://datasheet.lcsc.com/szlcsc/1811062009_UNI-ROYAL-Uniroyal-Elec-0603WAF1002T5E_C25804.pdf; Pin Count: 2; ComponentLink1Description: Datasheet
R314 R315 R318 R319 = CMP-010-000400-1: Resistor 10K 0805 ±1% Thick Film Uniroyal; Working Voltage: 150V; Temperature Coefficient: ±100ppm/K; Pin Count: 2; Temperature: -55 - 155°C; Manufacturer: Uniroyal; LCSC Part Number: C17414; ComponentLink1Description: Datasheet; ComponentLink1URL: https://datasheet.lcsc.com/szlcsc/1811062009_UNI-ROYAL-Uniroyal-Elec-0603WAF1002T5E_C25804.pdf
U300 = CMP-000000-7: Photovoltaic Full BridgeDriver 3A Non-Inv 28-Pin SOIC W T/R; ComponentLink1URL: https://www.ti.com/lit/ds/symlink/sm72295.pdf?HQS=dis-dk-null-digikeymode-dsf-pf-null-wwe&ts=1623830847089; ComponentLink1Description: Datasheet

## Sheet Panel Mode Switch.SchDoc: Panel Mode Switch
size A4; ApprovedBy: LD Stanton; Author: LD Stanton; CompanyName: University of Cape Town; DrawnBy: Lawrence Stanton; Engineer: Lawrence Stanton; Organization: University of Cape Town; Address1: Department of Electrical Engineering; Address2: Rondebosch; Address3: Cape Town; Address4: South Africa 7701; DocumentNumber: 7; SheetNumber: 7; SheetTotal: 20
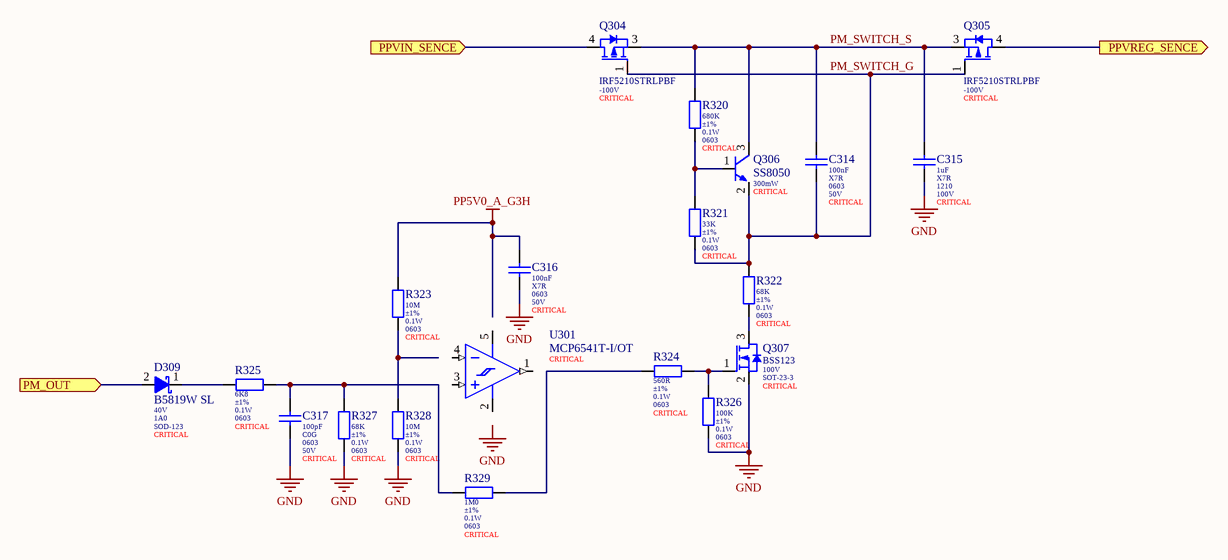
[diagram p9: Panel Mode Switch.SchDoc]

### Parts
C314  value 100nF  Dielectric: X7R  Package: 0603  Voltage: 50V  Populate: CRITICAL  [0603 (Yageo DA) B]  (hidden comment: CC0603KRX7R9BB104)
C315  value 1uF  Dielectric: X7R  Package: 1210  Voltage: 100V  Populate: CRITICAL  [1212_250_J (Samsumg) B]  (hidden comment: CL32B105KCJNNNE)
C316  value 100nF  Dielectric: X7R  Package: 0603  Voltage: 50V  Populate: CRITICAL  [0603 (Yageo DA) B]  (hidden comment: CC0603KRX7R9BB104)
C317  value 100pF  Dielectric: C0G  Package: 0603  Voltage: 50V  Populate: CRITICAL  [0603_080_8 (Samsung) B]  (hidden comment: CL10C101JB8NNNC)
D309  B5819W SL  Blocking Voltage: 40V  Forward Current: 1A0  Package: SOD-123  Placement: CRITICAL  [SOD-123 (JCET) B]
Q304  IRF5210STRLPBF  Maximum Drain Source Voltage: -100V  Placement: CRITICAL  [D2PAC (IRF5210) B]
Q305  IRF5210STRLPBF  Maximum Drain Source Voltage: -100V  Placement: CRITICAL  [D2PAC (IRF5210) B]
Q306  SS8050  Power: 300mW  Placement: CRITICAL  [SOT-23-5 (SS8050) B]
Q307  BSS123  Maximum Drain Source Voltage: 100V  Package: SOT-23-3  Placement: CRITICAL  [SOT-23-3 (2N7002) B]
R320  value 680K  Tolerance: ±1%  Power: 0.1W  Package: 0603  Populate: CRITICAL  [0603 (Uniroyal) B]  (hidden comment: 0603WAF6803T5E)
R321  value 33K  Tolerance: ±1%  Power: 0.1W  Package: 0603  Populate: CRITICAL  [0603 (Uniroyal) B]  (hidden comment: 0603WAF3302T5E)
R322  value 68K  Tolerance: ±1%  Power: 0.1W  Package: 0603  Populate: CRITICAL  [0603 (Uniroyal) B]  (hidden comment: 0603WAF6802T5E)
R323  value 10M  Tolerance: ±1%  Power: 0.1W  Package: 0603  Populate: CRITICAL  [0603 (Uniroyal) B]  (hidden comment: 0603WAF1005T5E)
R324  value 560R  Tolerance: ±1%  Power: 0.1W  Package: 0603  Populate: CRITICAL  [0603 (Uniroyal) B]  (hidden comment: 0603WAF5600T5E)
R325  value 6K8  Tolerance: ±1%  Power: 0.1W  Package: 0603  Populate: CRITICAL  [0603 (Uniroyal) B]  (hidden comment: 0603WAF6801T5E)
R326  value 100K  Tolerance: ±1%  Power: 0.1W  Package: 0603  Populate: CRITICAL  [0603 (Uniroyal) B]  (hidden comment: 0603WAF1003T5E)
R327  value 68K  Tolerance: ±1%  Power: 0.1W  Package: 0603  Populate: CRITICAL  [0603 (Uniroyal) B]  (hidden comment: 0603WAF6802T5E)
R328  value 10M  Tolerance: ±1%  Power: 0.1W  Package: 0603  Populate: CRITICAL  [0603 (Uniroyal) B]  (hidden comment: 0603WAF1005T5E)
R329  value 1M0  Tolerance: ±1%  Power: 0.1W  Package: 0603  Populate: CRITICAL  [0603 (Uniroyal) B]  (hidden comment: 0603WAF1004T5E)
U301  MCP6541T-I/OT  Placement: CRITICAL  [SOT-23-5 (MCP75x) B]

### Ports
PM_OUT (in), PPVIN_SENCE (in), PPVREG_SENCE (out)

### Nets
GND: C315.2 C316.2 C317.2 Q307.2(S) R326.2 R327.2 R328.2
PP5V0_A_G3H: C316.1 R323.1
P_PVIN_SENCE: Q304.4(D) ; port PPVIN_SENCE
P_PVREG_SENCE: Q305.4(D) ; port PPVREG_SENCE
PM_OUT: D309.2(A) ; port PM_OUT
PM_SWITCH_G: C314.2 Q304.1(G) Q305.1(G) Q306.2(E) R321.2 R322.1
PM_SWITCH_S: C314.1 C315.1 Q304.3(S) Q305.3(S) Q306.3(C) R320.1
NetC317_1: C317.1 R325.1 R327.1 R329.1
NetD309_1: D309.1(K) R325.2
NetQ306_1: Q306.1(B) R320.2 R321.1
NetQ307_1: Q307.1(G) R324.2 R326.1
NetQ307_3: Q307.3(D) R322.2
NetR323_2: R323.2 R328.1
NetR324_1: R324.1 R329.2

Not connected (* = marked no-connect by the designer): U301 1(OUT) 2(VSS) 3(VIN+) 4(VIN-) 5(VDD)

### Notes on the sheet
- Labels drawn without touching a wire or pin: GND
- Size:
- Date:
- A4
- Number:
- Time:
- Revision:
- Sheet
- of
- File:
- Author:

### Library data of the parts
C314 C316 = CMP-047-000000-7: MLCC 100nF 50V 0603 X7R ±10%; Manufacturer: Yageo; LCSC Part Number: C14663; Tolerance: ±10%; ComponentLink1URL: https://datasheet.lcsc.com/szlcsc/YAGEO-CC0603KRX7R9BB104_C14663.pdf; ComponentLink1Description: Datasheet
C315 = CMP-014-000009-3: MLCC 1uF 1210 100V X7R ±10%; Manufacturer: Samsung; ComponentLink1Description: Datasheet; Tolerance: ±10%; LCSC Part Number: C444847; ComponentLink1URL: https://datasheet.lcsc.com/szlcsc/Samsung-Electro-Mechanics-CL05C100JB5NNNC_C32949.pdf
C317 = CMP-045-000015-8: MLCC 100pF 0603 50V C0G ±0.1pF; Manufacturer: Samsung; ComponentLink1Description: Datasheet; LCSC Part Number: C14858; ComponentLink1URL: https://datasheet.lcsc.com/szlcsc/Samsung-Electro-Mechanics-CL05C100JB5NNNC_C32949.pdf; Tolerance: ±0.1pF
D309 = CMP-022-000009-2: Schottky Barrier Diode 40V 1A 600mV SOD-123 JCET; ComponentLink1URL: https://datasheet.lcsc.com/lcsc/1809140216_Changjiang-Electronics-Tech--CJ-B5819W-SL_C8598.pdf; LCSC Part Number: C8598; ComponentLink1Description: Datasheet
Q304 Q305 = CMP-040-000011-3: MOSFET P-Channel 100V 38A 3-Pin (2+Tab) D2PAK; Drain to Source Resistance: 60mR; Power Dissipation: 3.1W; Gate to Source Voltage (Vgs): 20V; Threshold Voltage: -4V; Min Operating Temperature: -55°C; Case/Package: D2PAK; Continuous Drain Current (ID): 38A; ComponentLink1Description: Datasheet; LCSC Part Number: C2622; RoHS Compliant: Yes; Polarity: P-CHANNEL; ComponentLink1URL: https://datasheet.lcsc.com/lcsc/1809201934_Infineon-Technologies-IRF5210STRLPBF_C2622.pdf; Rds On Max: 60mR; Max Operating Temperature: 150°C
Q306 = CMP-040-000005-4: BJT NPN 1A5 25V SOT-23-3; Manufacturer: Changjiang Electronics; Collector Emitter Saturation Voltage: 0V5; DC Gain: 120-400; Maximum Collector Emitter Voltage: 25V; ComponentLink1Description: Datasheet; Pin Count: 3; Component Type: Standard; ComponentLink1URL: https://datasheet.lcsc.com/lcsc/1809211023_Changjiang-Electronics-Tech--CJ-SS8050-G_C164886.pdf; Source: BJTs.SchLib; Maximum Collector Current: 1A5; LCSC Part Number: C2150
Q307 = CMP-040-000009-11: Small Signal MOSFET, 170mA, 100V, N-Channel, Enhancement, JCET SOT-23-3; Maximum Gate Source Voltage: ±20V; Power: 0.35W; Maximum Drain Current: 0.17A; Gate Threshold Voltage: 2V8; Drain-Source On Resistance: 10R; ComponentLink1Description: Datasheet; Manufacturer: JCET; ComponentLink1URL: https://datasheet.lcsc.com/lcsc/1809211016_Changjiang-Electronics-Tech--CJ-BSS123_C79015.pdf; LCSC Part Number: C79015
R320 = CMP-010-000364-3: Resistor 680K 0603 ±1% Thick Film Uniroyal; Temperature Coefficient: ±100ppm/K; Working Voltage: 75V; Manufacturer: Uniroyal; LCSC Part Number: C25822; ComponentLink1Description: Datasheet; Temperature: -55 - 155°C; ComponentLink1URL: https://datasheet.lcsc.com/szlcsc/1811062009_UNI-ROYAL-Uniroyal-Elec-0603WAF1002T5E_C25804.pdf; Pin Count: 2
R321 = CMP-010-000332-10: Resistor 33K 0603 ±1% Thick Film Uniroyal; Working Voltage: 75V; Temperature Coefficient: ±100ppm/K; Temperature: -55 - 155°C; ComponentLink1URL: https://datasheet.lcsc.com/szlcsc/1811062009_UNI-ROYAL-Uniroyal-Elec-0603WAF1002T5E_C25804.pdf; Manufacturer: Uniroyal; LCSC Part Number: C4216; ComponentLink1Description: Datasheet; Pin Count: 2
R322 R327 = CMP-010-000350-9: Resistor 68K 0603 ±1% Thick Film Uniroyal; Working Voltage: 75V; Temperature Coefficient: ±100ppm/K; Manufacturer: Uniroyal; ComponentLink1Description: Datasheet; Temperature: -55 - 155°C; ComponentLink1URL: https://datasheet.lcsc.com/szlcsc/1811062009_UNI-ROYAL-Uniroyal-Elec-0603WAF1002T5E_C25804.pdf; Pin Count: 2; LCSC Part Number: C23231
R323 R328 = CMP-010-000294-9: Resistor 10M 0603 ±1% Thick Film Uniroyal; Working Voltage: 75V; Temperature Coefficient: ±200ppm/K; Temperature: -55 - 155°C; Pin Count: 2; ComponentLink1URL: https://datasheet.lcsc.com/szlcsc/1811062009_UNI-ROYAL-Uniroyal-Elec-0603WAF1002T5E_C25804.pdf; Manufacturer: Uniroyal; LCSC Part Number: C7250; ComponentLink1Description: Datasheet
R324 = CMP-010-000387-3: Resistor 560R 0603 ±1% Thick Film Uniroyal; Working Voltage: 75V; Temperature Coefficient: ±200ppm/K; Pin Count: 2; Manufacturer: Uniroyal; ComponentLink1Description: Datasheet; Temperature: -55 - 155°C; ComponentLink1URL: https://datasheet.lcsc.com/szlcsc/1811062009_UNI-ROYAL-Uniroyal-Elec-0603WAF1002T5E_C25804.pdf; LCSC Part Number: C23204
R325 = CMP-010-000384-2: Resistor 6K8 0603 ±1% Thick Film Uniroyal; Temperature Coefficient: ±100ppm/K; Working Voltage: 75V; ComponentLink1URL: https://datasheet.lcsc.com/szlcsc/1811062009_UNI-ROYAL-Uniroyal-Elec-0603WAF1002T5E_C25804.pdf; ComponentLink1Description: Datasheet; Pin Count: 2; Temperature: -55 - 155°C; Manufacturer: Uniroyal; LCSC Part Number: C23212
R326 = CMP-010-000288-10: as R308 on sheet Bridge Regulator; Manufacturer: Uniroyal; ComponentLink1URL: https://datasheet.lcsc.com/szlcsc/1811062009_UNI-ROYAL-Uniroyal-Elec-0603WAF1002T5E_C25804.pdf; LCSC Part Number: C25803; Temperature: -55 - 155°C; ComponentLink1Description: Datasheet; Pin Count: 2
R329 = CMP-010-000313-12: as R306 on sheet Bridge Regulator; Manufacturer: Uniroyal; Pin Count: 2; LCSC Part Number: C22935; Temperature: -55 - 155°C; ComponentLink1Description: Datasheet; ComponentLink1URL: https://datasheet.lcsc.com/szlcsc/1811062009_UNI-ROYAL-Uniroyal-Elec-0603WAF1002T5E_C25804.pdf
U301 = CMP-000025-4: Comparator, Push-Pull, 1V6-5V5, 600nA,  SOT-23-5; Min Supply Voltage: 1.6V; Max Supply Voltage: 5.5V; Propagation Delay: 8us; Quiescent Current: 1uA; Nominal Supply Current: 1mA; Input Bias Current: 1pA; Input Offset Voltage (Vos): 7mV; Hysteresis: 6.5mV; Output Current: 2mA; Package: SOT-23-5; ComponentLink1Description: Datasheet; Output Type: Push-Pull; Min Operating Temperature: -40°C; RoHS: Yes; Max Operating Temperature: 85°C; ComponentLink1URL: https://ww1.microchip.com/downloads/en/DeviceDoc/MCP6541%20Output%20SubMicroamp%20Comparators%2020001696K.pdf; LCSC Part Number: C80839

## Sheet E-Fuse.SchDoc: 12V Electronic Fuse
size A4; ApprovedBy: LD Stanton; Author: LD Stanton; CompanyName: University of Cape Town; DrawnBy: Lawrence Stanton; Engineer: Lawrence Stanton; Organization: University of Cape Town; Address1: Department of Electrical Engineering; Address2: Rondebosch; Address3: Cape Town; Address4: South Africa 7701; DocumentNumber: 8; SheetNumber: 8; SheetTotal: 20
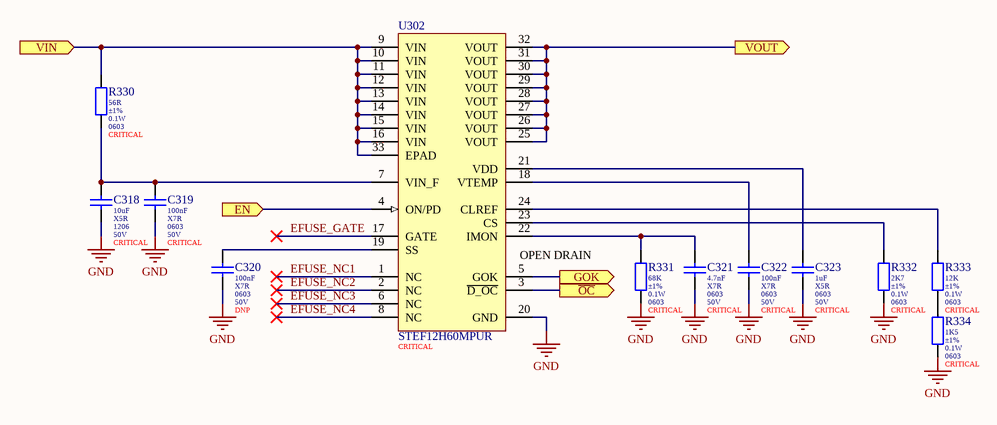
[diagram p10: E-Fuse.SchDoc]

### Parts
C318  value 10uF  Dielectric: X5R  Package: 1206  Voltage: 50V  Populate: CRITICAL  [1206_160_H (Samsumg) B]  (hidden comment: CL31A106KBHNNNE)
C319  value 100nF  Dielectric: X7R  Package: 0603  Voltage: 50V  Populate: CRITICAL  [0603 (Yageo DA) B]  (hidden comment: CC0603KRX7R9BB104)
C320  value 100nF  Dielectric: X7R  Package: 0603  Voltage: 50V  Populate: DNP  [0603 (Yageo DA) B]  (hidden comment: CC0603KRX7R9BB104)
C321  value 4.7nF  Dielectric: X7R  Package: 0603  Voltage: 50V  Populate: CRITICAL  [0603_080 (Guandong) B]  (hidden comment: 0603B472K500NT)
C322  value 100nF  Dielectric: X7R  Package: 0603  Voltage: 50V  Populate: CRITICAL  [0603 (Yageo DA) B]  (hidden comment: CC0603KRX7R9BB104)
C323  value 1uF  Dielectric: X5R  Package: 0603  Voltage: 50V  Populate: CRITICAL  [0603_080_8 (Samsung) B]  (hidden comment: CL10A105KB8NNNC)
R330  value 56R  Tolerance: ±1%  Power: 0.1W  Package: 0603  Populate: CRITICAL  [0603 (Uniroyal) B]  (hidden comment: 0603WAF5602T5E)
R331  value 68K  Tolerance: ±1%  Power: 0.1W  Package: 0603  Populate: CRITICAL  [0603 (Uniroyal) B]  (hidden comment: 0603WAF6802T5E)
R332  value 2K7  Tolerance: ±1%  Power: 0.1W  Package: 0603  Populate: CRITICAL  [0603 (Uniroyal) B]  (hidden comment: 0603WAF2701T5E)
R333  value 12K  Tolerance: ±1%  Power: 0.1W  Package: 0603  Populate: CRITICAL  [0603 (Uniroyal) B]  (hidden comment: 0603WAF1202T5E)
R334  value 1K5  Tolerance: ±1%  Power: 0.1W  Package: 0603  Populate: CRITICAL  [0603 (Uniroyal) B]  (hidden comment: 0603WAF1501T5E)
U302  STEF12H60MPUR  Placement: CRITICAL  [QFN32 (STEF12H60) B]

### Ports
EN (in), GOK (out), VIN (in), VOUT (out), ~{OC} (out)

### Nets
GND: C318.2 C319.2 C320.2 C321.2 C322.2 C323.2 R331.2 R332.2 R334.2 U302.20(GND)
PP_VBUS_FUSE_S0: R330.1 U302.9(VIN) U302.10(VIN) U302.11(VIN) U302.12(VIN) U302.13(VIN) U302.14(VIN) U302.15(VIN) U302.16(VIN) U302.33(EPAD) ; port VIN
PP_VBUS_S0: U302.25(VOUT) U302.26(VOUT) U302.27(VOUT) U302.28(VOUT) U302.29(VOUT) U302.30(VOUT) U302.31(VOUT) U302.32(VOUT) ; port VOUT
~{STOP}: U302.4(ON/PD) ; port EN
EFUSE_GATE: U302.17(GATE)
EFUSE_NC1: U302.1(NC)
EFUSE_NC2: U302.2(NC)
EFUSE_NC3: U302.6(NC)
EFUSE_NC4: U302.8(NC)
FUSE_OC: U302.3(~{D_OC}) ; port ~{OC}
FUSE_OK: U302.5(GOK) ; port GOK
NetC318_1: C318.1 C319.1 R330.2 U302.7(VIN_F)
NetC320_1: C320.1 U302.19(SS)
NetC321_1: C321.1 R331.1 U302.22(IMON)
NetC322_1: C322.1 U302.18(VTEMP)
NetC323_1: C323.1 U302.21(VDD)
NetR332_1: R332.1 U302.23(CS)
NetR333_1: R333.1 U302.24(CLREF)
NetR333_2: R333.2 R334.1

### Notes on the sheet
- (near U302) OPEN DRAIN
- Size:
- Date:
- A4
- Number:
- Time:
- Revision:
- Sheet
- of
- File:
- Author:

### Library data of the parts
C318 = CMP-045-000010-7: MLCC 10uF 1206 50V X5R ±10%; Manufacturer: Samsung; LCSC Part Number: C13585; ComponentLink1URL: https://datasheet.lcsc.com/szlcsc/Samsung-Electro-Mechanics-CL05C100JB5NNNC_C32949.pdf; Tolerance: ±10%; ComponentLink1Description: Datasheet
C319 C320 C322 = CMP-047-000000-7: as C314 on sheet Panel Mode Switch; LCSC Part Number: C14663; Tolerance: ±10%; ComponentLink1URL: https://datasheet.lcsc.com/szlcsc/YAGEO-CC0603KRX7R9BB104_C14663.pdf; ComponentLink1Description: Datasheet
C321 = CMP-014-000016-1: MLCC 4.7nF 0603 50V X7R ±10%; Manufacturer: Guandong; Tolerance: ±15%; ComponentLink1URL: https://datasheet.lcsc.com/szlcsc/Guangdong-Fenghua-Advanced-Tech-0402B102K500NT_C1523.pdf; ComponentLink1Description: Datasheet; LCSC Part Number: C53987
C323 = CMP-045-000002-9: MLCC 1uF 0603 50V X5R ±10%; Manufacturer: Samsung; Tolerance: ±10%; ComponentLink1URL: https://datasheet.lcsc.com/szlcsc/Samsung-Electro-Mechanics-CL05C100JB5NNNC_C32949.pdf; ComponentLink1Description: Datasheet; LCSC Part Number: C15849
R330 = CMP-010-000341-10: Resistor 56R 0603 ±1% Thick Film Uniroyal; Temperature Coefficient: ±200ppm/K; Working Voltage: 75V; Manufacturer: Uniroyal; ComponentLink1Description: Datasheet; LCSC Part Number: C25196; Temperature: -55 - 155°C; ComponentLink1URL: https://datasheet.lcsc.com/szlcsc/1811062009_UNI-ROYAL-Uniroyal-Elec-0603WAF1002T5E_C25804.pdf; Pin Count: 2
R331 = CMP-010-000350-9: as R322 on sheet Panel Mode Switch; Manufacturer: Uniroyal; ComponentLink1Description: Datasheet; Temperature: -55 - 155°C; ComponentLink1URL: https://datasheet.lcsc.com/szlcsc/1811062009_UNI-ROYAL-Uniroyal-Elec-0603WAF1002T5E_C25804.pdf; Pin Count: 2; LCSC Part Number: C23231
R332 = CMP-010-000326-9: Resistor 2K7 0603 ±1% Thick Film Uniroyal; Temperature Coefficient: ±100ppm/K; Working Voltage: 75V; ComponentLink1Description: Datasheet; LCSC Part Number: C13167; ComponentLink1URL: https://datasheet.lcsc.com/szlcsc/1811062009_UNI-ROYAL-Uniroyal-Elec-0603WAF1002T5E_C25804.pdf; Temperature: -55 - 155°C; Manufacturer: Uniroyal; Pin Count: 2
R333 = CMP-010-000351-11: Resistor 12K 0603 ±1% Thick Film Uniroyal; Working Voltage: 75V; Temperature Coefficient: ±100ppm/K; ComponentLink1URL: https://datasheet.lcsc.com/szlcsc/1811062009_UNI-ROYAL-Uniroyal-Elec-0603WAF1002T5E_C25804.pdf; ComponentLink1Description: Datasheet; LCSC Part Number: C22790; Pin Count: 2; Manufacturer: Uniroyal; Temperature: -55 - 155°C
R334 = CMP-010-000403-2: Resistor 1K5 0603 ±1% Thick Film Uniroyal; Temperature Coefficient: ±100ppm/K; Working Voltage: 75V; Temperature: -55 - 155°C; Manufacturer: Uniroyal; Pin Count: 2; ComponentLink1Description: Datasheet; LCSC Part Number: C22843; ComponentLink1URL: https://datasheet.lcsc.com/szlcsc/1811062009_UNI-ROYAL-Uniroyal-Elec-0603WAF1002T5E_C25804.pdf
U302 = CMP-000041-4: Electronic Fuse 60A 8-15V QFN32 ST; Manufacturer: ST Microelectronics; ComponentLink1Description: Datasheet; ComponentLink1URL: https://www.st.com/resource/en/datasheet/stef12h60m.pdf